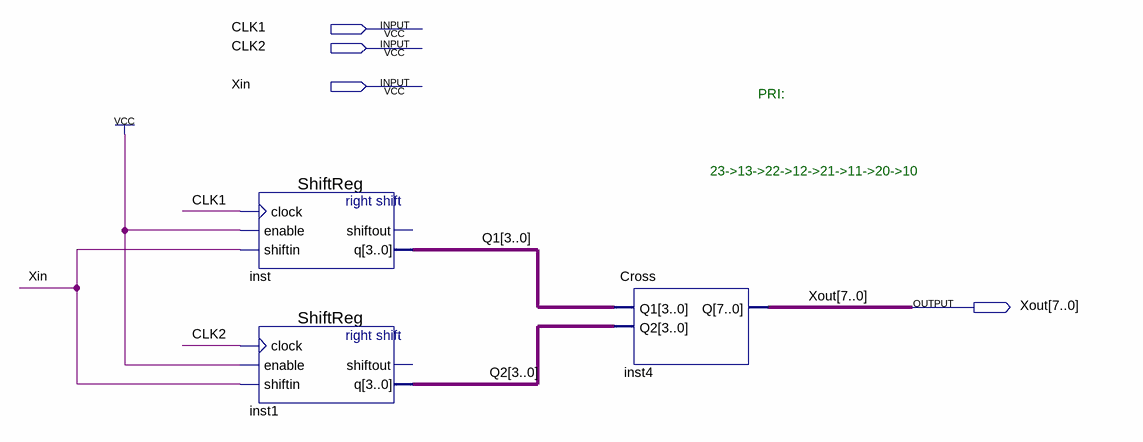
[diagram p0: schematic sheet]
// Quartus schematic ASignal.bdf as structural Verilog: 3 symbols, 4 pins
module ASignal (
  input  CLK1,
  input  CLK2,
  input  Xin,
  output [7:0] Xout
);

  wire [3:0] Q1, Q2;

  ShiftReg inst (.clock(CLK1), .enable(1'b1), .shiftin(Xin), .q(Q1));  // open: shiftout
  ShiftReg inst1 (.clock(CLK2), .enable(1'b1), .shiftin(Xin), .q(Q2));  // open: shiftout
  Cross inst4 (.Q1(Q1), .Q2(Q2), .Q(Xout));

  // Notes on the sheet:
  //   PRI:
  //   23->13->22->12->21->11->20->10
endmodule
